# Altium schematic sheet 5_unextended_ISO_periferals.SchDoc: =ProjectTitle
size A4; Address1: github.com/4pplet/cyber60; Address2: Licence: CERN-OHL-S; SheetNumber: 5; SheetTotal: 5
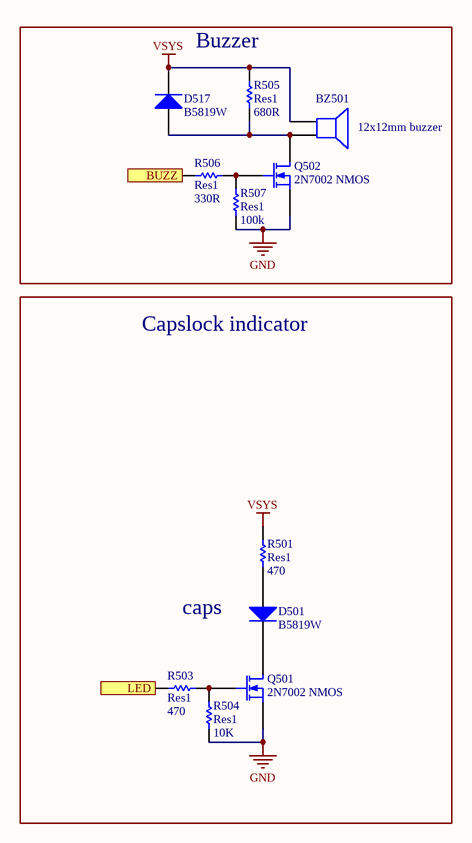
[diagram p0: 5_unextended_ISO_periferals.SchDoc]

## Parts
BZ501  12x12mm buzzer  [buzzer 12x12]
D501  B5819W  [MX-switch - CAPS - LED NO SWITCH]
D517  B5819W  [SOD-123]
Q501  2N7002 NMOS  [SOT-23-3]
Q502  2N7002 NMOS  [SOT-23-3]
R501  Res1  value 470  [R0603[1608]]
R503  Res1  value 470  [R0603[1608]]
R504  Res1  value 10K  [R0603[1608]]
R505  Res1  value 680R  [R0603[1608]]
R506  Res1  value 330R  [R0603[1608]]
R507  Res1  value 100k  [R0603[1608]]

## Blocks framed on the sheet
Buzzer: BZ501 D517 Q502 R505-R507

## Ports
BUZZ, LED

## Nets
GND: Q501.2(S) Q502.2(S) R504.2 R507.2
VSYS: BZ501.1 D517.2(K) R501.2 R505.1
BUZZ: R506.2 ; port BUZZ
LED: R503.1 ; port LED
NetBZ501_2: BZ501.2 D517.1(A) Q502.3(D) R505.2
NetD501_1: D501.1(A) R501.1
NetD501_2: D501.2(K) Q501.3(D)
NetQ501_1: Q501.1(G) R503.2 R504.1
NetQ502_1: Q502.1(G) R506.1 R507.1

## Notes on the sheet
- Capslock indicator
- caps
- Title
- Size:
- Date:
- A4
- Number:
- Time:
- Revision:
- Sheet
- of
- File:

## Library data of the parts
BZ501 = Speaker: Loudspeaker; MRF.Part: YS-SBZ1230; LCSC MFG: Fengming; LCSC Part #: C409829
D501 = Diode: Default Diode
D517 = Diode: Default Diode; LCSC MFG: Changjiang Electronics Tech (CJ); Version: SOD-123; LCSC Part #: C8598; MRF.Part: B5819W
Q501 Q502 = MOSFET-N: N-Channel MOSFET; LCSC MFG: Changjiang Electronics Tech (CJ); LCSC Part #: C8545; MRF.Part: 2N7002
R501 R503 = Res1: Resistor; MRF.Part: 0603WAF4700T5E; MFG: Panasonic Electronic Components; MFGPN: ERJ-3EKF5101V; LCSC MFG: UNI-ROYAL(Uniroyal Elec); Version: 0603 imperial; LCSC Part #: C23179
R504 = Res1: Resistor; MRF.Part: 0603WAF1002T5E; MFG: Panasonic Electronic Components; MFGPN: ERJ-3EKF5101V; LCSC MFG: Uniroyal Elec; Version: 0603 imperial; LCSC Part #: C25804
R505 = Res1: Resistor; MRF.Part: 0603WAF6800T5E; LCSC MFG: Uniroyal Elec; Version: 0603 imperial; LCSC Part #: C23228
R506 = Res1: Resistor; MRF.Part: 0603WAF3300T5E; LCSC MFG: Uniroyal Elec; Version: 0603 imperial; LCSC Part #: C23138
R507 = Res1: Resistor; MRF.Part: 0603WAF1003T5E; LCSC MFG: Uniroyal Elec; Version: 0603 imperial; LCSC Part #: C25803